# EAGLE design shield (EAGLE 5.11)
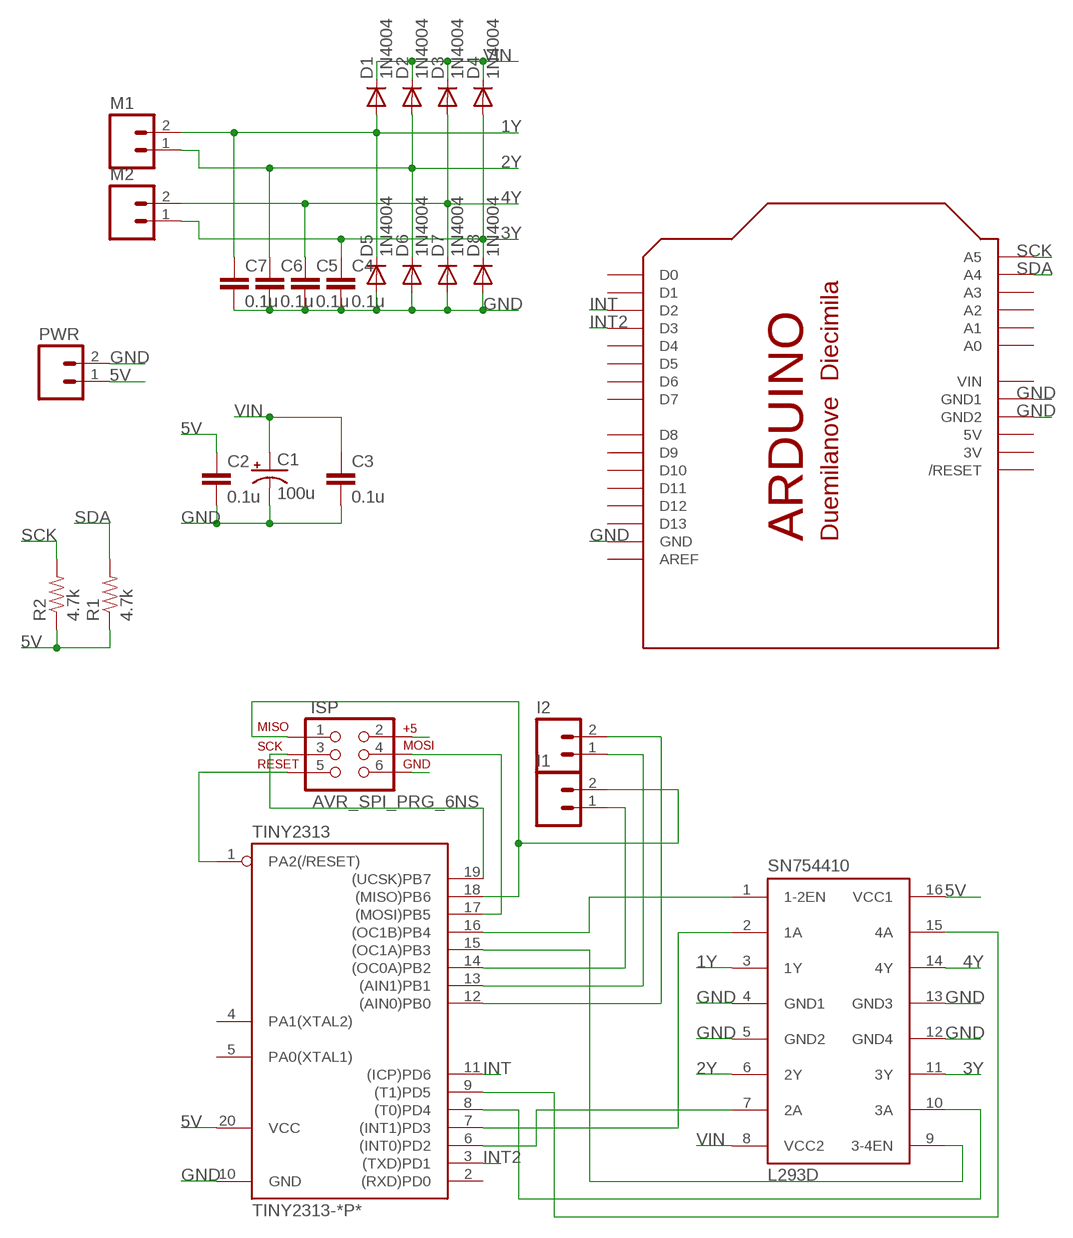
[diagram p0: schematic, sheet 1]

## Parts
C1  100u  CAP_POLPTH1  [CPOL-RADIAL-100UF-25V]
C2  0.1u  CAPPTH  [CAP-PTH-SMALL]
C3  0.1u  CAPPTH  [CAP-PTH-SMALL]
C4  0.1u  CAPPTH  [CAP-PTH-SMALL]
C5  0.1u  CAPPTH  [CAP-PTH-SMALL]
C6  0.1u  CAPPTH  [CAP-PTH-SMALL]
C7  0.1u  CAPPTH  [CAP-PTH-SMALL]
D1  1N4004  [DO41-10]
D2  1N4004  [DO41-10]
D3  1N4004  [DO41-10]
D4  1N4004  [DO41-10]
D5  1N4004  [DO41-10]
D6  1N4004  [DO41-10]
D7  1N4004  [DO41-10]
D8  1N4004  [DO41-10]
I1  M023.5MM  [SCREWTERMINAL-3.5MM-2]
I2  M023.5MM  [SCREWTERMINAL-3.5MM-2]
ISP  AVR_SPI_PRG_6NS  [2X3-NS]
M1  M023.5MM  [SCREWTERMINAL-3.5MM-2]
M2  M023.5MM  [SCREWTERMINAL-3.5MM-2]
PWR  M023.5MM  [SCREWTERMINAL-3.5MM-2]
R1  4.7k  RESISTORPTH-1/4W  [AXIAL-0.4]
R2  4.7k  RESISTORPTH-1/4W  [AXIAL-0.4]
SN754410  L293D  [DIL16]
TINY2313  TINY2313-*P*  [DIL20]
U$1  ARDUINO-NODIM  [ARDUINO-NODIM]

## Nets
1Y: C7.1 D1.A D5.C M1.2 SN754410.3(1Y)
2Y: C6.1 D2.A D6.C M1.1 SN754410.6(2Y)
3Y: C4.1 D4.A D8.C M2.1 SN754410.11(3Y)
4Y: C5.1 D3.A D7.C M2.2 SN754410.14(4Y)
5V: C2.1 ISP.2 PWR.1 R1.P$1 R2.P$1 SN754410.16(VCC1) TINY2313.20(VCC)
GND: C1.2(-) C2.2 C3.2 C4.2 C5.2 C6.2 C7.2 D5.A D6.A D7.A D8.A ISP.6 PWR.2 SN754410.4(GND1) SN754410.5(GND2) SN754410.12(GND4) SN754410.13(GND3) TINY2313.10(GND) U$1.GND U$1.GND1 U$1.GND2
INT: TINY2313.11((ICP)PD6) U$1.D2
INT2: TINY2313.3((TXD)PD1) U$1.D3
MISO: I1.2 ISP.1 TINY2313.18((MISO)PB6)
N$1: SN754410.1(1-2EN) TINY2313.16((OC1B)PB4)
N$2: SN754410.9(3-4EN) TINY2313.15((OC1A)PB3)
N$4: SN754410.15(4A) TINY2313.9((T1)PD5)
N$5: SN754410.10(3A) TINY2313.8((T0)PD4)
N$6: SN754410.2(1A) TINY2313.7((INT1)PD3)
N$7: I1.1 TINY2313.14((OC0A)PB2)
N$8: I2.1 TINY2313.13((AIN1)PB1)
N$9: I2.2 TINY2313.12((AIN0)PB0)
N$10: SN754410.7(2A) TINY2313.6((INT0)PD2)
RESET: ISP.5 TINY2313.1(PA2(/RESET))
SCK: ISP.3 R2.P$2 TINY2313.19((UCSK)PB7) U$1.A5
SDA: ISP.4 R1.P$2 TINY2313.17((MOSI)PB5) U$1.A4
VIN: C1.1(+) C3.1 D1.C D2.C D3.C D4.C SN754410.8(VCC2)
Unconnected: TINY2313.2((RXD)PD0) TINY2313.4(PA1(XTAL2)) TINY2313.5(PA0(XTAL1)) U$1.A0 U$1.A1 U$1.A2 U$1.A3 U$1.AREF U$1.D0 U$1.D1 U$1.D4 U$1.D5 U$1.D6 U$1.D7 U$1.D8 U$1.D9 U$1.D10 U$1.D11 U$1.D12 U$1.D13 U$1.RESET(/RESET)

## Power pins joined to a net without a drawn wire
3V: U$1.3V
5V: U$1.5V
VIN: U$1.VIN

## Library data of the parts
C1 = SparkFun:CAP_POL: Capacitor Polarized These are standard SMD and PTH capacitors. Normally 10uF, 47uF, and 100uF in electrolytic and tantalum varieties. Always verify the external diameter of the through hole cap, it varies with capacity, voltage, and manufacturer. The EIA devices should be standard.
C2-C7 = SparkFun:CAP: Capacitor Standard 0603 ceramic capacitor, and 0.1" leaded capacitor.
D1-D8 = diode:1N4004: DIODE general purpose rectifier, 1 A
I1 I2 M1 M2 PWR = SparkFun:M02: Header 2 Standard 2-pin 0.1" header. Use with straight break away headers (SKU : PRT-00116), right angle break away headers (PRT-00553), swiss pins (PRT-00743), machine pins (PRT-00117), and female headers (PRT-00115). Molex polarized connector foot print use with SKU : PRT-08233 with associated crimp pins and housings.
ISP = SparkFun:AVR_SPI_PRG_6: AVR ISP 6 Pin This is the reduced ISP connector for AVR programming. Common on Arduino. This footprint will take up less PCB space and can be used with a 10-pin to 6-pin adapter such as SKU: BOB-08508
R1 R2 = SparkFun:RESISTOR: Resistor Basic schematic elements and footprints for 0603, 1206, and PTH resistors.
SN754410 = st-microelectronics:L293D: PUSH-PULL 4 CHANNEL DRIVER; MPN: L293D; OC_FARNELL: 9589619; OC_NEWARK: 56P8249
TINY2313 = avr-6:TINY2313*: Atmel Tiny2313 2K Flash, 128 bytes EEPROM, 128 bytes RAM
U$1 = adafruit:ARDUINO: Arduino Diecimila/Duemilanove Make a shield with ease, this package has all the named pins as well as the two mounting drill holes and an outline of the USB and DC power connector. The outline is on the DIMENSION layer, so if your board house uses it they will cut the outline to match. http://www.ladyada.net/library/pcb/eaglelibrary.html

## Board
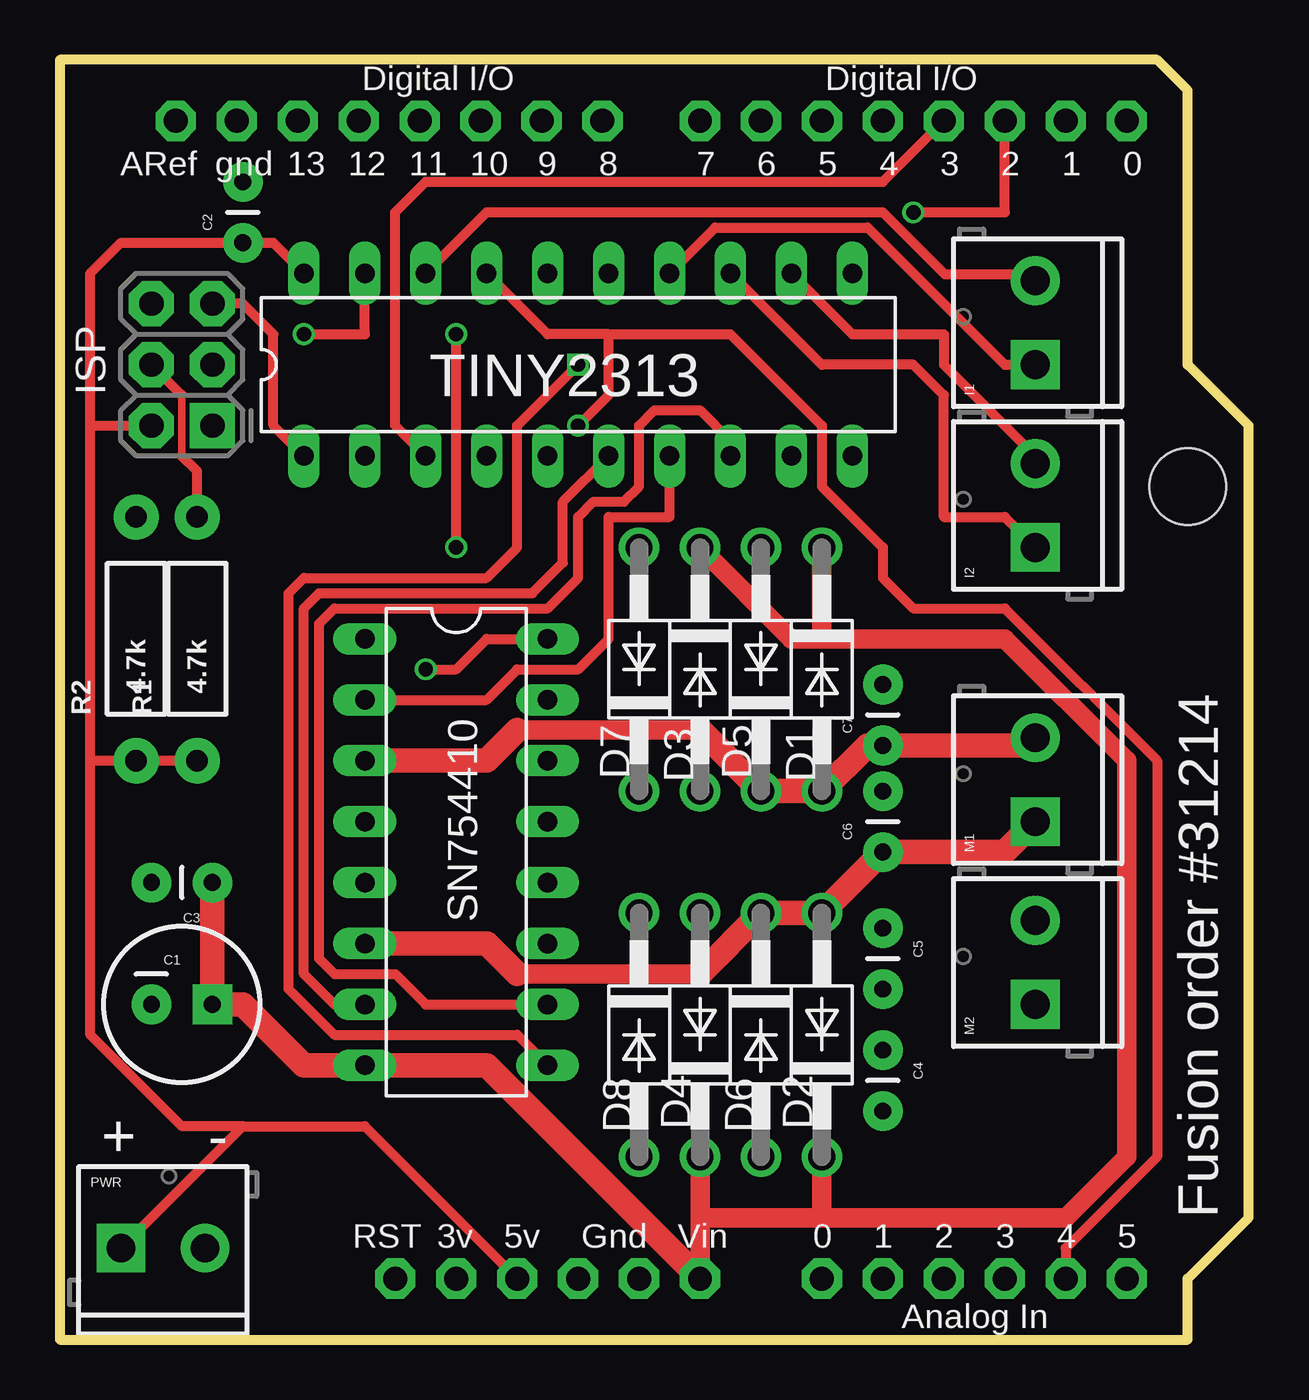
[diagram p1: board, top side]
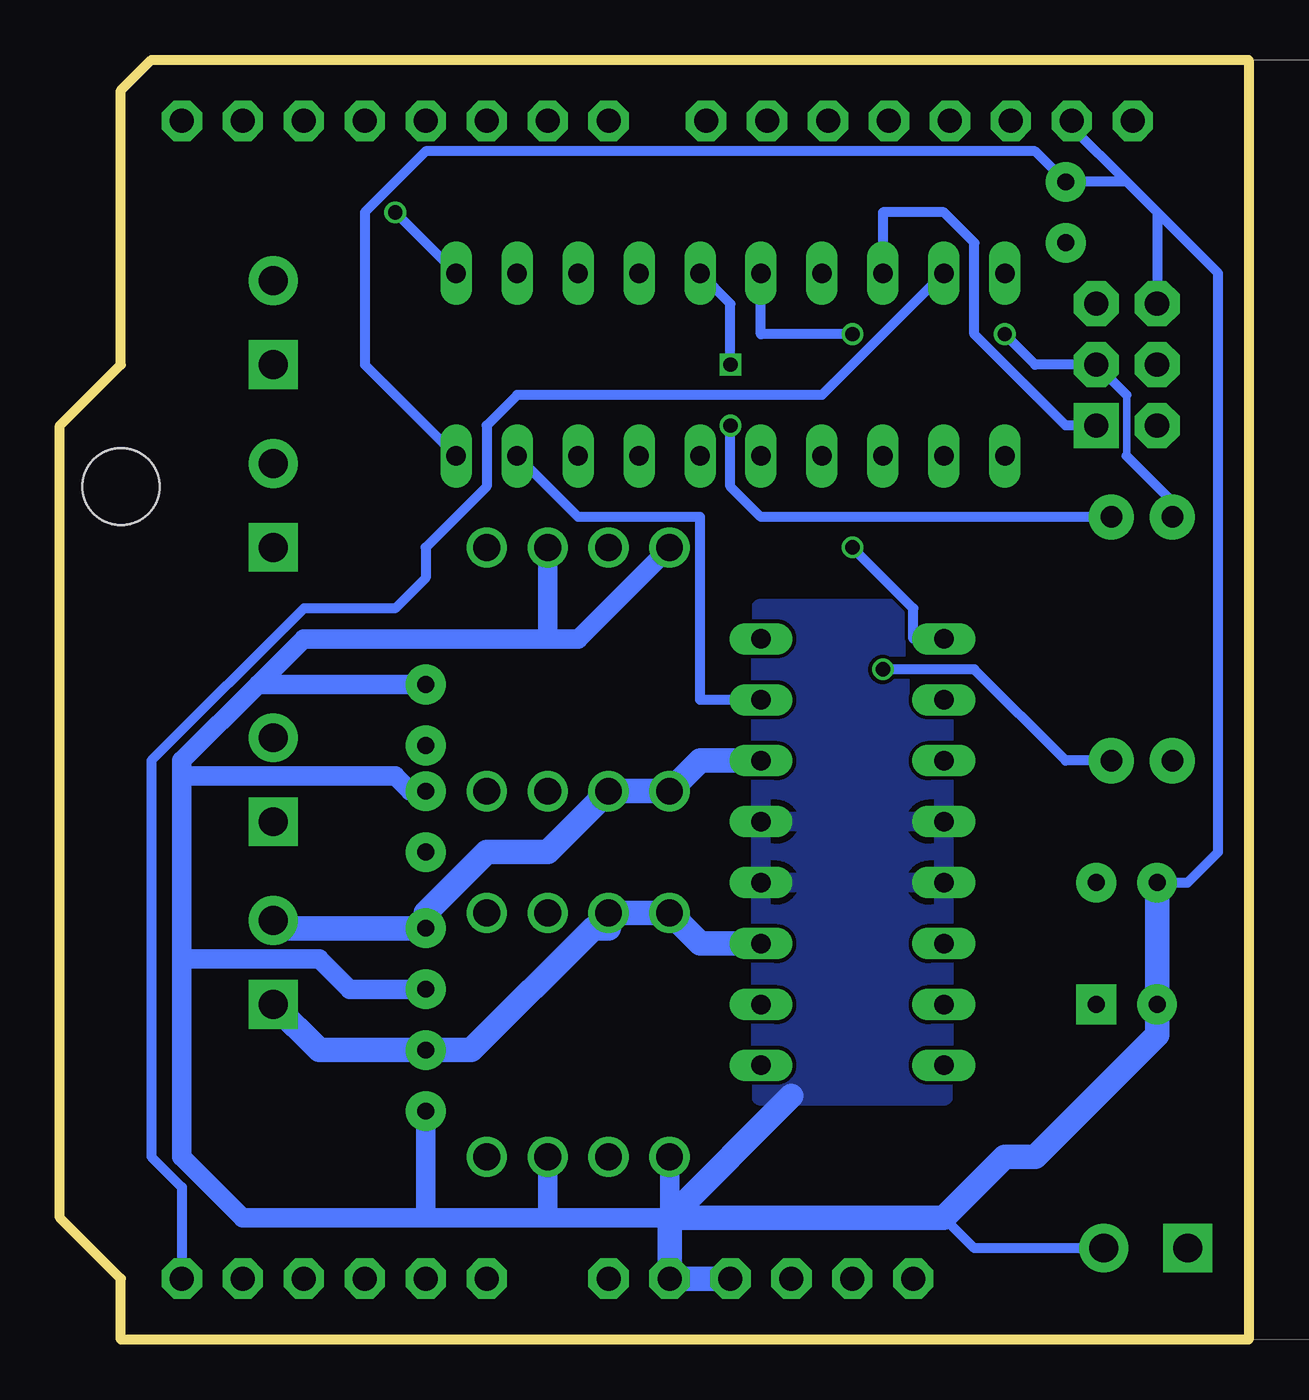
[diagram p2: board, bottom side, seen from below]

Size 49.53 x 53.34 mm. Coordinates in mm from the lower left corner, seen from the top.
Outline: 0,53.33 0,0
Outline: 0,0 46.99,0 46.99,2.54 49.53,5.08 49.53,38.1 46.99,40.64 46.99,52.07 45.72,53.34 0,53.34 0,0
Copper layers (1*16): Top 0.035mm / dielectric 1.5mm / Bottom 0.035mm
Design rules "Fusion_eagle_rule_v1.1": minimum track width 6mil, minimum drill 12mil, track to track 6mil, track to pad 6mil, pad to pad 6mil, via to via 6mil, smd to smd 0mil, copper to edge 10mil, drill to drill 10mil, minimum pad ring 10mil, minimum via ring 6mil, stop-mask expansion 2mil, vias tented up to drill 100mil, thermal gap 10mil

### Footprints (pad centres in the part's own frame; a part is rotated, then mirrored left to right if it is on the bottom)
CPOL-RADIAL-100UF-25V = drill 0.7 pad 1.651 square: 1 1.27,0 | drill 0.7 pad 1.651 round: 2 -1.27,0
CAP-PTH-SMALL = drill 0.7 pad 1.651 round: 1 0,0; 2 2.54,0
DO41-10 = drill 1.118 round: A 5.08,0; C -5.08,0
SCREWTERMINAL-3.5MM-2 = drill 1.2 pad 2.032 square: 1 0,0 | drill 1.2 pad 2.032 round: 2 3.5,0
2X3-NS = drill 1.016 pad 1.88 square: 1 -2.54,-1.27 | drill 1.016 pad 1.88 octagon: 2 -2.54,1.27; 3 0,-1.27; 4 0,1.27; 5 2.54,-1.27; 6 2.54,1.27
AXIAL-0.4 = drill 0.9 pad 1.88 round: P$1 -5.08,0; P$2 5.08,0
DIL16 = drill 0.813 long: 1 -8.89,-3.81; 2 -6.35,-3.81; 3 -3.81,-3.81; 4 -1.27,-3.81; 5 1.27,-3.81; 6 3.81,-3.81; 7 6.35,-3.81; 8 8.89,-3.81; 9 8.89,3.81; 10 6.35,3.81; 11 3.81,3.81; 12 1.27,3.81; 13 -1.27,3.81; 14 -3.81,3.81; 15 -6.35,3.81; 16 -8.89,3.81
DIL20 = drill 0.813 long: 1 -11.43,-3.81; 2 -8.89,-3.81; 3 -6.35,-3.81; 4 -3.81,-3.81; 5 -1.27,-3.81; 6 1.27,-3.81; 7 3.81,-3.81; 8 6.35,-3.81; 9 8.89,-3.81; 10 11.43,-3.81; 11 11.43,3.81; 12 8.89,3.81; 13 6.35,3.81; 14 3.81,3.81; 15 1.27,3.81; 16 -1.27,3.81; 17 -3.81,3.81; 18 -6.35,3.81; 19 -8.89,3.81; 20 -11.43,3.81
ARDUINO-NODIM = drill 1 pad 1.676 octagon: 3V 35.56,2.54; 5V 38.1,2.54; A0 50.8,2.54; A1 53.34,2.54; A2 55.88,2.54; A3 58.42,2.54; A4 60.96,2.54; A5 63.5,2.54; AREF 23.876,50.8; D0 63.5,50.8; D1 60.96,50.8; D2 58.42,50.8; D3 55.88,50.8; D4 53.34,50.8; D5 50.8,50.8; D6 48.26,50.8; D7 45.72,50.8; D8 41.656,50.8; D9 39.116,50.8; D10 36.576,50.8; D11 34.036,50.8; D12 31.496,50.8; D13 28.956,50.8; GND 26.416,50.8; GND1 43.18,2.54; GND2 40.64,2.54; RESET 33.02,2.54; VIN 45.72,2.54 | hole 3.2: 66.04,35.56

### Placement (x,y rotation side)
C1  5.08,13.97 0 top
C2  7.62,45.72 90 top
C3  6.35,19.05 180 top
C4  34.29,12.06 270 top
C5  34.29,17.14 270 top
C6  34.29,20.32 90 top
C7  34.29,24.77 90 top
D1  31.75,27.94 270 top
D2  31.75,12.7 90 top
D3  26.67,27.94 270 top
D4  26.67,12.7 90 top
D5  29.21,27.94 90 top
D6  29.21,12.7 270 top
D7  24.13,27.94 90 top
D8  24.13,12.7 270 top
I1  40.64,40.64 90 top
I2  40.64,33.02 90 top
ISP  5.08,40.64 90 top
M1  40.64,21.59 90 top
M2  40.64,13.97 90 top
PWR  2.54,3.81 0 top
R1  5.71,29.21 90 top
R2  3.17,29.21 90 top
SN754410  16.51,20.32 270 top
TINY2313  21.59,40.64 0 top
U$1  -19.05,0 0 top

### Tracks (layer width: path | path; a pad name or v marks a point on that pad's centre or on a via)
1Y
  Top 0.813: 19.05,25.4 26.67,25.4
  Top 1.016: SN754410.3 17.78,24.13 19.05,25.4 | 26.67,25.4 D5.C D1.A 33.66,24.77 C7.1 40.31,24.77 M1.2
2Y
  Top 0.813: 19.05,15.24 26.67,15.24
  Top 1.016: SN754410.6 17.78,16.51 19.05,15.24 | 26.67,15.24 D6.C D2.A C6.1 39.37,20.32 M1.1
3Y
  Bottom 1.016: SN754410.11 22.86,16.51 D8.C D4.A 26.67,17.14 27.3,17.14 32.38,12.06 C4.1 38.73,12.06 M2.1
4Y
  Bottom 1.016: SN754410.14 22.86,24.13 D7.C D3.A 29.21,20.32 31.75,20.32 34.29,17.78 C5.1 40.31,17.14 M2.2
5V  (via drill 0.6)
  Top 0.406: R1.P$1 R2.P$1 1.27,24.13 | U$1.5V 12.7,8.89 7.62,8.89 | 7.62,8.89 5.08,8.89 1.27,12.7 1.27,24.13 | 1.27,24.13 1.27,38.1 | 1.27,38.1 1.27,44.45 2.54,45.72 C2.1 8.89,45.72 TINY2313.20 | 1.27,38.1 ISP.2 | v15.24,27.94 16.51,27.94 17.78,29.21 SN754410.16 | PWR.1 7.62,8.89
  Bottom 0.406: R1.P$1 7.62,24.13 11.43,27.94 v15.24,27.94
GND
  Bottom 0.406: U$1.GND 7.37,50.55 5.08,48.26 | 3.81,46.99 1.27,44.45 1.27,20.32 2.54,19.05 C3.2 | 3.81,46.99 5.08,48.26 | 3.81,46.99 ISP.6 | 5.08,48.26 C2.2 8.89,49.53 34.29,49.53 36.83,46.99 36.83,40.64 TINY2313.10 | PWR.2 11.43,3.81 12.7,5.08
  Bottom 0.813: 29.21,5.08 34.29,5.08 | 34.29,5.08 41.91,5.08 44.45,7.62 44.45,15.88 | 44.45,15.88 44.45,23.5 | 44.45,23.5 44.45,24.13 41.27,27.3 | D8.A 24.13,5.08 29.21,5.08 | 29.21,5.08 D6.A | 34.29,5.08 C4.2 | C6.2 34.92,22.86 35.56,23.5 44.45,23.5 | C5.2 37.47,14.61 38.73,15.88 44.45,15.88 | 41.27,27.3 39.37,29.21 29.21,29.21 | 29.21,29.21 27.94,29.21 D7.A | 29.21,29.21 D5.A | 41.27,27.3 C7.2
  Bottom 1.016: 24.13,5.08 19.05,10.16 | C3.2 C1.2 3.81,12.7 8.89,7.62 10.16,7.62 12.7,5.08 24.13,5.08 | U$1.GND2 U$1.GND1 24.13,5.08
  pour Bottom: 12.7,30.48 20.32,30.48 20.32,10.16 12.7,10.16
INT  (via drill 0.6)
  Top 0.406: v35.56,46.99 39.37,46.99 U$1.D2
  Bottom 0.406: TINY2313.11 v35.56,46.99
INT2
  Top 0.406: U$1.D3 34.29,48.26 15.24,48.26 13.97,46.99 13.97,38.1 TINY2313.3
MISO
  Top 0.406: TINY2313.18 17.78,46.99 34.29,46.99 36.87,44.41 40.37,44.41 I1.2
  Bottom 0.406: TINY2313.18 15.24,46.99 12.7,46.99 11.43,45.72 11.43,41.91 7.62,38.1 ISP.1
N$1  (via drill 0.6)
  Top 0.406: v16.51,33.02 v16.51,41.91
  Bottom 0.406: TINY2313.16 20.32,41.91 v16.51,41.91 | v16.51,33.02 13.97,30.48 13.97,29.21 SN754410.1
N$2  (via drill 0.6)
  Top 0.406: SN754410.9 19.05,12.7 11.43,12.7 9.53,14.61 9.53,31.11 10.16,31.75 17.78,31.75 19.05,33.02 19.05,38.1 v21.59,40.64
  Bottom 0.406: v21.59,40.64 21.59,43.18 TINY2313.15
N$4
  Bottom 0.406: TINY2313.9 27.94,34.29 22.86,34.29 22.86,26.67 SN754410.15
N$5
  Top 0.406: TINY2313.8 27.94,37.47 26.67,38.73 24.77,38.73 24.13,38.1 24.13,35.56 23.5,34.92 22.23,34.92 21.59,34.29 21.59,31.75 20.32,30.48 11.43,30.48 10.79,29.84 10.79,15.88 11.43,15.24 13.97,15.24 15.24,13.97 SN754410.10
N$6
  Top 0.406: TINY2313.7 25.4,34.29 22.86,34.29 22.86,29.21 21.59,27.94 19.05,27.94 17.78,26.67 SN754410.2
N$7
  Top 0.406: TINY2313.14 27.3,46.35 33.66,46.35 39.37,40.64 I1.1
N$8
  Top 0.406: TINY2313.13 31.75,40.64 35.56,40.64 36.83,39.37 36.83,34.29 39.37,34.29 I2.1
N$9
  Top 0.406: TINY2313.12 33.02,41.91 36.83,41.91 36.83,40.64 40.64,36.83 I2.2
N$10
  Top 0.406: TINY2313.6 20.95,34.92 20.95,32.38 19.68,31.11 10.79,31.11 10.16,30.48 10.16,15.24 11.43,13.97 SN754410.7
RESET
  Top 0.406: ISP.5 7.62,43.18 8.89,41.91 8.89,38.1 TINY2313.1
SCK  (via drill 0.6)
  Top 0.406: v10.16,41.91 12.7,41.91 TINY2313.19
  Bottom 0.305: 5.08,36.83 5.08,39.37
  Bottom 0.406: R2.P$2 3.17,34.92 5.08,36.83 | 5.08,39.37 ISP.3 8.89,40.64 v10.16,41.91 | U$1.A5 44.45,6.35 45.72,7.62 45.72,24.13 39.37,30.48 35.56,30.48 34.29,31.75 34.29,33.02 31.75,35.56 31.75,38.1 30.48,39.37 17.78,39.37 TINY2313.19
SDA  (via drill 0.6)
  Top 0.305: 5.08,36.83 5.08,39.37
  Top 0.406: U$1.A4 41.91,3.81 45.72,7.62 45.72,24.13 39.37,30.48 35.56,30.48 34.29,31.75 34.29,33.02 31.75,35.56 31.75,38.1 27.94,41.91 22.86,41.91 | R1.P$2 5.71,36.2 5.08,36.83 | 5.08,39.37 ISP.4 | 22.86,41.91 20.32,41.91 TINY2313.17 | v21.59,38.1 22.86,39.37 22.86,41.91
  Bottom 0.406: v21.59,38.1 21.59,35.56 20.32,34.29 R1.P$2
VIN
  Top 0.813: U$1.VIN 26.67,5.08 | 26.67,5.08 31.75,5.08 | 31.75,5.08 41.91,5.08 44.45,7.62 44.45,24.13 39.37,29.21 31.75,29.21 | 31.75,5.08 D2.C | 26.67,5.08 D4.C | 31.75,29.21 30.48,29.21 D3.C | 31.75,29.21 D1.C
  Top 1.016: U$1.VIN 17.78,11.43 SN754410.8 10.16,11.43 7.62,13.97 C1.1 C3.1

### Text on the board
tNames: + | - | Fusion order #31214